# Altium project Jumperless_breadboard_REV1.PrjPcb (part 4 of 4)

## Sheet ESP32 DEV.SchDoc
size A; SheetNumber: 13; SheetTotal: 14
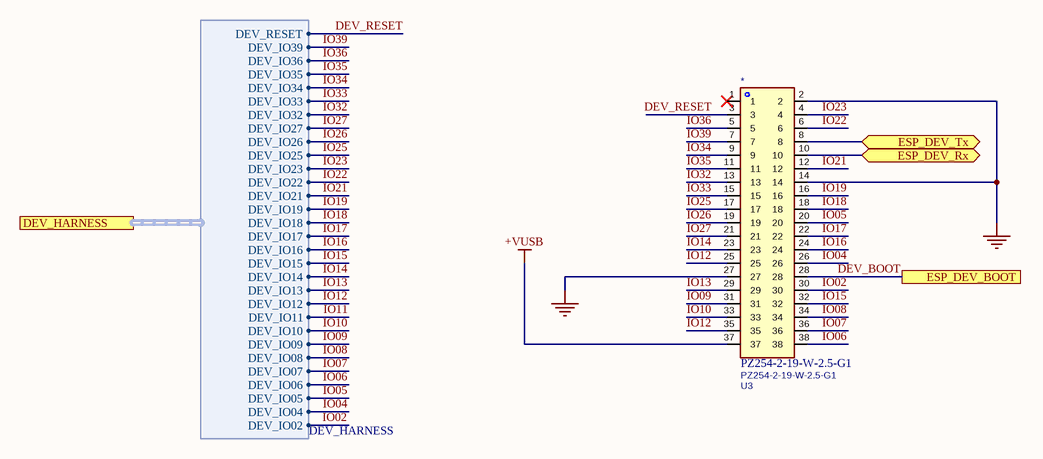
[diagram p30: ESP32 DEV.SchDoc]

### Parts
*  PZ254-2-19-W-2.5-G1  Reference: U3  [HDR-TH_38P-P2.54-H-M-R2-C19-S2.54]

### Ports
DEV_HARNESS (harness DEV_HARNESS), ESP_DEV_BOOT, ESP_DEV_Rx (bidir), ESP_DEV_Tx (bidir)

### Harnesses
DEV_HARNESS: DEV_IO02, DEV_IO04, DEV_IO05, DEV_IO06, DEV_IO07, DEV_IO08, DEV_IO09, DEV_IO10, DEV_IO11, DEV_IO12, DEV_IO13, DEV_IO14, DEV_IO15, DEV_IO16, DEV_IO17, DEV_IO18, DEV_IO19, DEV_IO21, DEV_IO22, DEV_IO23, DEV_IO25, DEV_IO26, DEV_IO27, DEV_IO32, DEV_IO33, DEV_IO34, DEV_IO35, DEV_IO36, DEV_IO39, DEV_RESET

### Nets
+VUSB: *.37  [project net ANALOG_5V]
GND: *.2 *.14 *.27  [project net REF]
DEV_BOOT: *.28 ; port ESP_DEV_BOOT
DEV_RESET: *.3 ; port DEV_HARNESS.DEV_RESET
IO02: *.30 ; port DEV_HARNESS.DEV_IO02  [project net D8]
IO04: *.26 ; port DEV_HARNESS.DEV_IO04  [project net D10]
IO05: *.20 ; port DEV_HARNESS.DEV_IO05  [project net \]
IO06: *.38 ; port DEV_HARNESS.DEV_IO06  [project net D4]
IO07: *.36 ; port DEV_HARNESS.DEV_IO07  [project net A5]
IO08: *.34 ; port DEV_HARNESS.DEV_IO08  [project net D6]
IO09: *.31 ; port DEV_HARNESS.DEV_IO09  [project net A1]
IO10: *.33 ; port DEV_HARNESS.DEV_IO10  [project net D2]
IO12: *.25 *.35 ; port DEV_HARNESS.DEV_IO12  [project net D13]
IO13: *.29 ; port DEV_HARNESS.DEV_IO13  [project net D0]
IO14: *.23 ; port DEV_HARNESS.DEV_IO14  [project net D9]
IO15: *.32 ; port DEV_HARNESS.DEV_IO15  [project net A7]
IO16: *.24 ; port DEV_HARNESS.DEV_IO16  [project net D12]
IO17: *.22 ; port DEV_HARNESS.DEV_IO17  [project net AREF]
IO18: *.18 ; port DEV_HARNESS.DEV_IO18  [project net GPIO39]
IO19: *.16 ; port DEV_HARNESS.DEV_IO19  [project net GPIO40]
IO21: *.12 ; port DEV_HARNESS.DEV_IO21  [project net GPIO41]
IO22: *.6 ; port DEV_HARNESS.DEV_IO22  [project net GPIO42]
IO23: *.4 ; port DEV_HARNESS.DEV_IO23  [project net GPIO45]
IO25: *.17 ; port DEV_HARNESS.DEV_IO25  [project net A6]
IO26: *.19 ; port DEV_HARNESS.DEV_IO26  [project net D7]
IO27: *.21 ; port DEV_HARNESS.DEV_IO27  [project net D11]
IO32: *.13 ; port DEV_HARNESS.DEV_IO32  [project net A4]
IO33: *.15 ; port DEV_HARNESS.DEV_IO33  [project net D5]
IO34: *.9 ; port DEV_HARNESS.DEV_IO34  [project net A2]
IO35: *.11 ; port DEV_HARNESS.DEV_IO35  [project net D3]
IO36: *.5 ; port DEV_HARNESS.DEV_IO36  [project net A0]
IO39: *.7 ; port DEV_HARNESS.DEV_IO39  [project net D1]
Net*_8: *.8 ; port ESP_DEV_Tx
Net*_10: *.10 ; port ESP_DEV_Rx

Not connected (* = marked no-connect by the designer): * 1*

### Library data of the parts
* = PZ254-2-19-W-2.5-G1: Footprint: easyeda2kicad:HDR-TH_38P-P2.54-H-M-R2-C19-S2.54; LCSC Part: C18198033; Value: PZ254-2-19-W-2.5-G1

## Sheet UART_2_MUX.SchDoc
size 250 x 160 mm; SheetNumber: 15; SheetTotal: 15
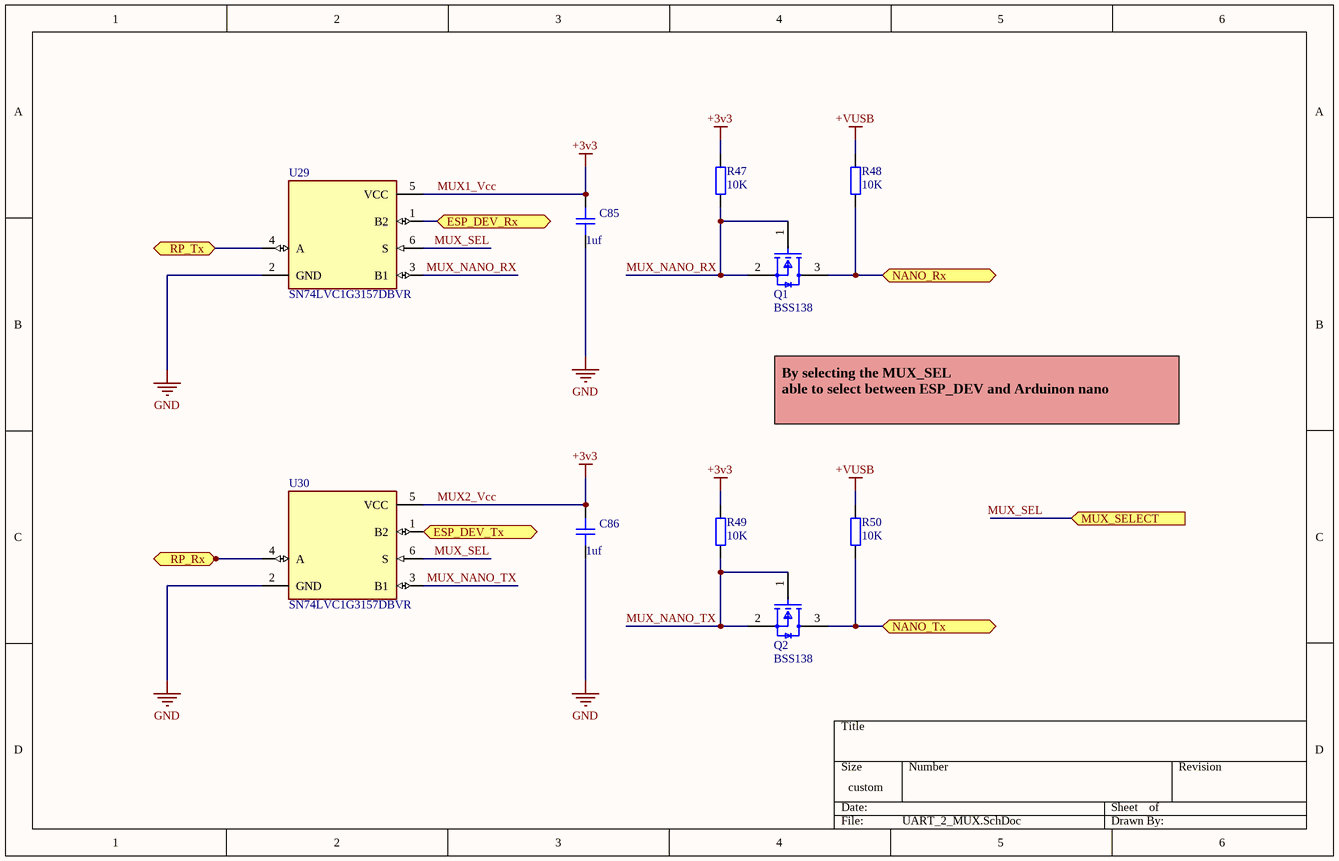
[diagram p31: UART_2_MUX.SchDoc]

### Parts
C85  1uf  [CAP_0603]
C86  1uf  [CAP_0603]
Q1  BSS138  [FP-318-08-IPC_B]
Q2  BSS138  [FP-318-08-IPC_B]
R47  10K  [RES_0603]
R48  10K  [RES_0603]
R49  10K  [RES_0603]
R50  10K  [RES_0603]
U29  SN74LVC1G3157DBVR  [FP-DBV0006A-IPC_C]
U30  SN74LVC1G3157DBVR  [FP-DBV0006A-IPC_C]

### Ports
ESP_DEV_Rx (bidir), ESP_DEV_Tx (bidir), MUX_SELECT (in), NANO_Rx (bidir), NANO_Tx (bidir), RP_Rx (bidir), RP_Tx (bidir)

### Nets
+3v3: C85.2 C86.2 R47.1 R49.1 U29.5(VCC) U30.5(VCC)  [also labelled MUX1_Vcc, MUX2_Vcc]  [project net BUCK1_3v3]
+VUSB: R48.1 R50.1  [project net ANALOG_5V]
GND: C85.1 C86.1 U29.2(GND) U30.2(GND)  [project net REF]
CROSS_Rx: U30.4(A) ; port RP_Rx
CROSS_Tx: U29.4(A) ; port RP_Tx
D0: Q1.3(D) R48.2 ; port NANO_Rx
D1: Q2.3(D) R50.2 ; port NANO_Tx
MUX_NANO_RX: Q1.1(G) Q1.2(S) R47.2 U29.3(B1)  [project net MUX_NANO_RX_15]
MUX_NANO_TX: Q2.1(G) Q2.2(S) R49.2 U30.3(B1)  [project net MUX_NANO_TX_15]
MUX_SEL: U29.6(S) U30.6(S) ; port MUX_SELECT  [project net GPIO0_RP]
Net*_8: U30.1(B2) ; port ESP_DEV_Tx
Net*_10: U29.1(B2) ; port ESP_DEV_Rx

### Notes on the sheet
- By selecting the MUX_SEL
  able to select between ESP_DEV and Arduinon nano

### Library data of the parts
C85 C86 = CAP_0603: Capacitor SMD 0603; Manufacturer: *; Manufacturer Part Number: *; Distributor Link: *; LCSC: *; Rating: *; Dielectric: *
Q1 Q2 = CMP-07173-000101-1: MOSFET N-CH 50V 220MA SOT-23; Turn-Off Delay Time: 20ns; Element Configuration: Single; Rds On Max: 3.5R; Gate to Source Voltage (Vgs): 20V; Threshold Voltage: 1.3V; Number of Elements: 1; Power Dissipation: 360mW; Rise Time: 9ns; Turn-On Delay Time: 2.5ns; Input Capacitance: 27pF; On-State Resistance: 6R; Lead Free: Lead Free; Length: 2.92mm; Width: 1.3mm; Drain to Source Breakdown Voltage: 50V; Min Operating Temperature: -55°C; REACH SVHC: No SVHC; Packaging: Tape and Reel; Radiation Hardening: No; Height: 0.93mm; Drain to Source Voltage (Vdss): 50V; Current Rating: 220mA; Voltage Rating (DC): 50V; Weight: 0.03g; Continuous Drain Current (ID): 220mA; Number of Pins: 3; Nominal Vgs: 1.3V; Max Power Dissipation: 360mW; Fall Time: 9ns; Drain to Source Resistance: 3.5R; Contact Plating: Tin; Case/Package: SOT-23; Package Quantity: 1; Dual Supply Voltage: 50V; Mount: Surface Mount; Termination: SMD/SMT; Max Operating Temperature: 150°C
R47-R50 = RES_0603: Resistor SMD 0603; Manufacturer: *; Manufacturer Part Number: *; Distributor Link: *; LCSC: *
U29 U30 = CMP-0859-00203-4: IC SWITCH SPDT SOT23-6; Number of Outputs: 2; Propagation Delay: 300ps; On-State Resistance: 15R; Nominal Supply Current: 10uA; Number of Inputs: 1; Max Supply Voltage: 5.5V; Supply Type: Single; Low Level Output Current: 128mA; Bandwidth: 300MHz; Turn-Off Delay Time: 3.8ns; Turn-On Delay Time: 5.7ns; Operating Supply Current: 1uA; Min Supply Voltage: 1.65V; Polarity: Non-Inverting; Height: 1.3mm; Number of Bits: 1; Case/Package: SOT-23; REACH SVHC: No SVHC; High Level Output Current: 128mA; Weight: 0.000229oz; Max Supply Current: 10uA; Width: 1.75mm; Radiation Hardening: No; Supply Current: 10uA; Length: 3.05mm; Max Operating Temperature: 125°C; Min Operating Temperature: -40°C; Package Quantity: 3000; Number of Pins: 6; Termination: SMD/SMT; Series: 74LVC; Packaging: Tape and Reel; Lead Free: Lead Free; Contact Plating: Gold; Mount: Surface Mount; RoHS Compliant: Yes; Number of Channels: 1; Throw Configuration: SPDT

## Nets that join several sheets
+8V: Main (S1.1), +-9V Supply (D3.1 R11.1 TP6.1), ANALOG_CIRCUITS (U21.4)
+FUNV: Main (J6.1), 9v_BOOST_CONVERTERS (C81.2 C82.2 D411.1 R44.2)
+OSCV: Main (J5.1), 9v_BOOST_CONVERTERS (C77.2 C78.2 D410.1 R41.2)
-8V: Main (S1.5), +-9V Supply (D9.2 R13.1 TP16.1), ANALOG_CIRCUITS (U21.6)
ANALOG_5V: Main (8 pins), USB MUX (D2.5), +-9V Supply (6 pins), ANALOG_CIRCUITS (C45.2 R26.2 U1.1 U2.4), CONTROL_ROUTING_CROSSPOINTS (U24.1 U26.1), WS2812B_ARRAY (400 pins), 9v_BOOST_CONVERTERS (JP2.2 JP4.2), NANO_HEADER (U31.15), ESP32 DEV (*.37), UART_2_MUX (R48.1 R50.1)
BUCK1_3v3: Main (6 pins), USB MUX (C5.2 SW1.3 SW1.4 U4.4), RP2040 MCU (22 pins), ESP32 S3 MINI (8 pins), ANALOG_CIRCUITS (11 pins), CONTROL_ROUTING_CROSSPOINTS (U23.1), 9v_BOOST_CONVERTERS (JP1.2 JP3.2), UART_2_MUX (6 pins)
CH446_VDD: BREADBOARD_MATTRIX (16 pins), +-9V Supply (5 pins), ANALOG_CIRCUITS (U18.4), CONTROL_ROUTING_CROSSPOINTS (8 pins)
CH446_VEE: BREADBOARD_MATTRIX (8 pins), +-9V Supply (5 pins), ANALOG_CIRCUITS (U18.11), CONTROL_ROUTING_CROSSPOINTS (U23.16 U24.16 U25.16 U26.16)
REF: Main (15 pins), USB MUX (6 pins), BREADBOARD_MATTRIX (80 pins), RP2040 MCU (26 pins), ESP32 S3 MINI (26 pins), +-9V Supply (10 pins), BreadBoard (J3.62 J3.64), ANALOG_CIRCUITS (22 pins), CONTROL_ROUTING_CROSSPOINTS (42 pins), WS2812B_ARRAY (400 pins), 9v_BOOST_CONVERTERS (14 pins), NANO_HEADER (U31.14 U31.19), ESP32 DEV (*.2 *.14 *.27), UART_2_MUX (C85.1 C86.1 U29.2 U30.2)
\: ESP32 S3 MINI (U16.43), CONTROL_ROUTING_CROSSPOINTS (U24.25), NANO_HEADER (U31.13 U31.18), ESP32 DEV (*.20)
A0: ESP32 S3 MINI (U16.6), CONTROL_ROUTING_CROSSPOINTS (U23.31), NANO_HEADER (U31.4), ESP32 DEV (*.5)
A1: ESP32 S3 MINI (U16.18), CONTROL_ROUTING_CROSSPOINTS (U24.30), NANO_HEADER (U31.5), ESP32 DEV (*.31)
A2: ESP32 S3 MINI (U16.8), CONTROL_ROUTING_CROSSPOINTS (U23.29), NANO_HEADER (U31.6), ESP32 DEV (*.9)
A3: ESP32 S3 MINI (U16.23), CONTROL_ROUTING_CROSSPOINTS (U24.28), NANO_HEADER (U31.7)
A4: ESP32 S3 MINI (U16.10), CONTROL_ROUTING_CROSSPOINTS (U23.27), NANO_HEADER (U31.8), ESP32 DEV (*.13)
A5: ESP32 S3 MINI (U16.27), CONTROL_ROUTING_CROSSPOINTS (U24.26), NANO_HEADER (U31.9), ESP32 DEV (*.36)
A6: ESP32 S3 MINI (U16.12), CONTROL_ROUTING_CROSSPOINTS (U23.3), NANO_HEADER (U31.10), ESP32 DEV (*.17)
A7: ESP32 S3 MINI (U16.38), CONTROL_ROUTING_CROSSPOINTS (U24.4), NANO_HEADER (U31.11), ESP32 DEV (*.32)
ADC_BUFF_5V_0: RP2040 MCU (U13.41), ANALOG_CIRCUITS (TP8.1 U2.1 U2.2)
ADC_BUFF_5V_1: RP2040 MCU (U13.40), ANALOG_CIRCUITS (TP9.1 U2.8 U2.9)
ADC_BUFF_5V_2: RP2040 MCU (U13.39), ANALOG_CIRCUITS (TP11.1 U2.13 U2.14)
ADC_BUFF_+-8V: RP2040 MCU (U13.38), ANALOG_CIRCUITS (TP13.1 U2.6 U2.7)
AREF: ESP32 S3 MINI (U16.42), CONTROL_ROUTING_CROSSPOINTS (U24.8), NANO_HEADER (U31.3), ESP32 DEV (*.22)
B_B2: BREADBOARD_MATTRIX (U5.35), BreadBoard (J3.2)
B_B3: BREADBOARD_MATTRIX (U5.37), BreadBoard (J3.3)
B_B4: BREADBOARD_MATTRIX (U5.39), BreadBoard (J3.4)
B_B5: BREADBOARD_MATTRIX (U5.17), BreadBoard (J3.5)
B_B6: BREADBOARD_MATTRIX (U5.15), BreadBoard (J3.6)
B_B7: BREADBOARD_MATTRIX (U5.13), BreadBoard (J3.7)
B_B8: BREADBOARD_MATTRIX (U5.11), BreadBoard (J3.8)
B_B9: BREADBOARD_MATTRIX (U6.35), BreadBoard (J3.9)
B_B10: BREADBOARD_MATTRIX (U6.37), BreadBoard (J3.10)
B_B11: BREADBOARD_MATTRIX (U6.39), BreadBoard (J3.11)
B_B12: BREADBOARD_MATTRIX (U6.17), BreadBoard (J3.12)
B_B13: BREADBOARD_MATTRIX (U6.15), BreadBoard (J3.13)
B_B14: BREADBOARD_MATTRIX (U6.13), BreadBoard (J3.14)
B_B15: BREADBOARD_MATTRIX (U6.11), BreadBoard (J3.15)
B_B16: BREADBOARD_MATTRIX (U7.35), BreadBoard (J3.16)
B_B17: BREADBOARD_MATTRIX (U7.37), BreadBoard (J3.17)
B_B18: BREADBOARD_MATTRIX (U7.39), BreadBoard (J3.18)
B_B19: BREADBOARD_MATTRIX (U7.17), BreadBoard (J3.19)
B_B20: BREADBOARD_MATTRIX (U7.15), BreadBoard (J3.20)
B_B21: BREADBOARD_MATTRIX (U7.13), BreadBoard (J3.21)
B_B22: BREADBOARD_MATTRIX (U7.11), BreadBoard (J3.22)
B_B23: BREADBOARD_MATTRIX (U8.35), BreadBoard (J3.23)
B_B24: BREADBOARD_MATTRIX (U8.37), BreadBoard (J3.24)
B_B25: BREADBOARD_MATTRIX (U8.39), BreadBoard (J3.25)
B_B26: BREADBOARD_MATTRIX (U8.17), BreadBoard (J3.26)
B_B27: BREADBOARD_MATTRIX (U8.15), BreadBoard (J3.27)
B_B28: BREADBOARD_MATTRIX (U8.13), BreadBoard (J3.28)
B_B29: BREADBOARD_MATTRIX (U8.11), BreadBoard (J3.29)
B_B33: BREADBOARD_MATTRIX (U9.35), BreadBoard (J3.33)
B_B34: BREADBOARD_MATTRIX (U9.37), BreadBoard (J3.34)
B_B35: BREADBOARD_MATTRIX (U9.39), BreadBoard (J3.35)
B_B36: BREADBOARD_MATTRIX (U9.17), BreadBoard (J3.36)
B_B37: BREADBOARD_MATTRIX (U9.15), BreadBoard (J3.37)
B_B38: BREADBOARD_MATTRIX (U9.13), BreadBoard (J3.38)
B_B39: BREADBOARD_MATTRIX (U9.11), BreadBoard (J3.39)
B_B40: BREADBOARD_MATTRIX (U10.35), BreadBoard (J3.40)
B_B41: BREADBOARD_MATTRIX (U10.37), BreadBoard (J3.41)
B_B42: BREADBOARD_MATTRIX (U10.39), BreadBoard (J3.42)
B_B43: BREADBOARD_MATTRIX (U10.17), BreadBoard (J3.43)
B_B44: BREADBOARD_MATTRIX (U10.15), BreadBoard (J3.44)
B_B45: BREADBOARD_MATTRIX (U10.13), BreadBoard (J3.45)
B_B46: BREADBOARD_MATTRIX (U10.11), BreadBoard (J3.46)
B_B47: BREADBOARD_MATTRIX (U11.35), BreadBoard (J3.47)
B_B48: BREADBOARD_MATTRIX (U11.37), BreadBoard (J3.48)
B_B49: BREADBOARD_MATTRIX (U11.39), BreadBoard (J3.49)
B_B50: BREADBOARD_MATTRIX (U11.17), BreadBoard (J3.50)
B_B51: BREADBOARD_MATTRIX (U11.15), BreadBoard (J3.51)
B_B52: BREADBOARD_MATTRIX (U11.13), BreadBoard (J3.52)
B_B53: BREADBOARD_MATTRIX (U11.11), BreadBoard (J3.53)
B_B54: BREADBOARD_MATTRIX (U12.35), BreadBoard (J3.54)
B_B55: BREADBOARD_MATTRIX (U12.37), BreadBoard (J3.55)
B_B56: BREADBOARD_MATTRIX (U12.39), BreadBoard (J3.56)
B_B57: BREADBOARD_MATTRIX (U12.17), BreadBoard (J3.57)
B_B58: BREADBOARD_MATTRIX (U12.15), BreadBoard (J3.58)
B_B59: BREADBOARD_MATTRIX (U12.13), BreadBoard (J3.59)
B_B60: BREADBOARD_MATTRIX (U12.11), BreadBoard (J3.60)
BB_1: BreadBoard (J3.1), CONTROL_ROUTING_CROSSPOINTS (U26.5)
BB_30: BreadBoard (J3.30), CONTROL_ROUTING_CROSSPOINTS (U26.6)
BB_31: BreadBoard (J3.31), CONTROL_ROUTING_CROSSPOINTS (U26.8)
BB_32: BreadBoard (J3.32), CONTROL_ROUTING_CROSSPOINTS (U26.7)
BB_BOTTOM_RAIL: Main (S1.7), BreadBoard (J3.63)
BB_TOP_RAIL: Main (S1.3), BreadBoard (J3.61)
CH446_CLK: BREADBOARD_MATTRIX (8 pins), RP2040 MCU (U13.18), CONTROL_ROUTING_CROSSPOINTS (U23.34 U24.34 U25.34 U26.34)
CH446_CS_A: BREADBOARD_MATTRIX (U5.14), RP2040 MCU (U13.8)
CH446_CS_B: BREADBOARD_MATTRIX (U6.14), RP2040 MCU (U13.9)
CH446_CS_C: BREADBOARD_MATTRIX (U7.14), RP2040 MCU (U13.11)
CH446_CS_D: BREADBOARD_MATTRIX (U8.14), RP2040 MCU (U13.12)
CH446_CS_E: BREADBOARD_MATTRIX (U9.14), RP2040 MCU (U13.13)
CH446_CS_F: BREADBOARD_MATTRIX (U10.14), RP2040 MCU (U13.14)
CH446_CS_G: BREADBOARD_MATTRIX (U11.14), RP2040 MCU (U13.15)
CH446_CS_H: BREADBOARD_MATTRIX (U12.14), RP2040 MCU (U13.16)
CH446_CS_I: RP2040 MCU (U13.31), CONTROL_ROUTING_CROSSPOINTS (U23.14)
CH446_CS_J: RP2040 MCU (U13.32), CONTROL_ROUTING_CROSSPOINTS (U24.14)
CH446_CS_K: RP2040 MCU (U13.34), CONTROL_ROUTING_CROSSPOINTS (U25.14)
CH446_CS_L: RP2040 MCU (U13.35), CONTROL_ROUTING_CROSSPOINTS (U26.14)
CH446_DATA: BREADBOARD_MATTRIX (8 pins), RP2040 MCU (U13.17), CONTROL_ROUTING_CROSSPOINTS (U23.36 U24.36 U25.36 U26.36)
CH446_RESET: BREADBOARD_MATTRIX (8 pins), RP2040 MCU (U13.36), CONTROL_ROUTING_CROSSPOINTS (U23.41 U24.41 U25.41 U26.41)
CROSS_AI: BREADBOARD_MATTRIX (U5.31), CONTROL_ROUTING_CROSSPOINTS (U23.33)
CROSS_AJ: BREADBOARD_MATTRIX (U5.30), CONTROL_ROUTING_CROSSPOINTS (U24.33)
CROSS_AK: BREADBOARD_MATTRIX (U5.6), CONTROL_ROUTING_CROSSPOINTS (U25.33)
CROSS_AL: BREADBOARD_MATTRIX (U5.33), CONTROL_ROUTING_CROSSPOINTS (U26.33)
CROSS_BI: BREADBOARD_MATTRIX (U6.29), CONTROL_ROUTING_CROSSPOINTS (U23.35)
CROSS_BJ: BREADBOARD_MATTRIX (U6.28), CONTROL_ROUTING_CROSSPOINTS (U24.35)
CROSS_BK: BREADBOARD_MATTRIX (U6.8), CONTROL_ROUTING_CROSSPOINTS (U25.35)
CROSS_BL: BREADBOARD_MATTRIX (U6.33), CONTROL_ROUTING_CROSSPOINTS (U26.35)
CROSS_CI: BREADBOARD_MATTRIX (U7.27), CONTROL_ROUTING_CROSSPOINTS (U23.37)
CROSS_CJ: BREADBOARD_MATTRIX (U7.26), CONTROL_ROUTING_CROSSPOINTS (U24.37)
CROSS_CK: BREADBOARD_MATTRIX (U7.24), CONTROL_ROUTING_CROSSPOINTS (U25.37)
CROSS_CL: BREADBOARD_MATTRIX (U7.33), CONTROL_ROUTING_CROSSPOINTS (U26.37)
CROSS_DI: BREADBOARD_MATTRIX (U8.3), CONTROL_ROUTING_CROSSPOINTS (U23.39)
CROSS_DJ: BREADBOARD_MATTRIX (U8.4), CONTROL_ROUTING_CROSSPOINTS (U24.39)
CROSS_DK: BREADBOARD_MATTRIX (U8.2), CONTROL_ROUTING_CROSSPOINTS (U25.39)
CROSS_DL: BREADBOARD_MATTRIX (U8.33), CONTROL_ROUTING_CROSSPOINTS (U26.39)
CROSS_EI: BREADBOARD_MATTRIX (U9.30), CONTROL_ROUTING_CROSSPOINTS (U23.17)
CROSS_EJ: BREADBOARD_MATTRIX (U9.5), CONTROL_ROUTING_CROSSPOINTS (U24.17)
CROSS_EK: BREADBOARD_MATTRIX (U9.6), CONTROL_ROUTING_CROSSPOINTS (U25.17)
CROSS_EL: BREADBOARD_MATTRIX (U9.33), CONTROL_ROUTING_CROSSPOINTS (U26.17)
CROSS_FI: BREADBOARD_MATTRIX (U10.28), CONTROL_ROUTING_CROSSPOINTS (U23.15)
CROSS_FJ: BREADBOARD_MATTRIX (U10.7), CONTROL_ROUTING_CROSSPOINTS (U24.15)
CROSS_FK: BREADBOARD_MATTRIX (U10.8), CONTROL_ROUTING_CROSSPOINTS (U25.15)
CROSS_FL: BREADBOARD_MATTRIX (U10.33), CONTROL_ROUTING_CROSSPOINTS (U26.15)
CROSS_GI: BREADBOARD_MATTRIX (U11.26), CONTROL_ROUTING_CROSSPOINTS (U23.13)
CROSS_GJ: BREADBOARD_MATTRIX (U11.25), CONTROL_ROUTING_CROSSPOINTS (U24.13)
CROSS_GK: BREADBOARD_MATTRIX (U11.24), CONTROL_ROUTING_CROSSPOINTS (U25.13)
CROSS_GL: BREADBOARD_MATTRIX (U11.33), CONTROL_ROUTING_CROSSPOINTS (U26.13)
CROSS_HI: BREADBOARD_MATTRIX (U12.4), CONTROL_ROUTING_CROSSPOINTS (U23.11)
CROSS_HJ: BREADBOARD_MATTRIX (U12.1), CONTROL_ROUTING_CROSSPOINTS (U24.11)
CROSS_HK: BREADBOARD_MATTRIX (U12.2), CONTROL_ROUTING_CROSSPOINTS (U25.11)
CROSS_HL: BREADBOARD_MATTRIX (U12.33), CONTROL_ROUTING_CROSSPOINTS (U26.11)
CROSS_Rx: RP2040 MCU (U13.27), CONTROL_ROUTING_CROSSPOINTS (U26.25), UART_2_MUX (U30.4)
CROSS_Tx: RP2040 MCU (U13.28), CONTROL_ROUTING_CROSSPOINTS (U26.24), UART_2_MUX (U29.4)
CURRENT_SCL: RP2040 MCU (R35.1 U13.7 U15.5), ANALOG_CIRCUITS (R17.1 R20.1 U19.4 U20.4)
CURRENT_SDA: RP2040 MCU (R36.1 U13.6 U15.6), ANALOG_CIRCUITS (R16.1 R19.1 U19.3 U20.3)
D0: ESP32 S3 MINI (U16.17), CONTROL_ROUTING_CROSSPOINTS (U24.31), NANO_HEADER (U31.17), ESP32 DEV (*.29), UART_2_MUX (Q1.3 R48.2)
D1: ESP32 S3 MINI (U16.7), CONTROL_ROUTING_CROSSPOINTS (U23.30), NANO_HEADER (U31.16), ESP32 DEV (*.7), UART_2_MUX (Q2.3 R50.2)
D2: ESP32 S3 MINI (U16.19), CONTROL_ROUTING_CROSSPOINTS (U24.29), NANO_HEADER (U31.20), ESP32 DEV (*.33)
D3: ESP32 S3 MINI (U16.9), CONTROL_ROUTING_CROSSPOINTS (U23.28), NANO_HEADER (U31.21), ESP32 DEV (*.11)
D4: ESP32 S3 MINI (U16.24), CONTROL_ROUTING_CROSSPOINTS (U24.27), NANO_HEADER (U31.22), ESP32 DEV (*.38)
D5: ESP32 S3 MINI (U16.11), CONTROL_ROUTING_CROSSPOINTS (U23.26), NANO_HEADER (U31.23), ESP32 DEV (*.15)
D6: ESP32 S3 MINI (U16.28), CONTROL_ROUTING_CROSSPOINTS (U24.3), NANO_HEADER (U31.24), ESP32 DEV (*.34)
D7: ESP32 S3 MINI (U16.13), CONTROL_ROUTING_CROSSPOINTS (U23.4), NANO_HEADER (U31.25), ESP32 DEV (*.19)
D8: ESP32 S3 MINI (U16.39), CONTROL_ROUTING_CROSSPOINTS (U24.5), NANO_HEADER (U31.26), ESP32 DEV (*.30)
D9: ESP32 S3 MINI (U16.15), CONTROL_ROUTING_CROSSPOINTS (U23.6), NANO_HEADER (U31.27), ESP32 DEV (*.23)
D10: ESP32 S3 MINI (U16.40), CONTROL_ROUTING_CROSSPOINTS (U24.6), NANO_HEADER (U31.28), ESP32 DEV (*.26)
D11: ESP32 S3 MINI (U16.14), CONTROL_ROUTING_CROSSPOINTS (U23.5), NANO_HEADER (U31.29), ESP32 DEV (*.21)
D12: ESP32 S3 MINI (U16.41), CONTROL_ROUTING_CROSSPOINTS (U24.7), NANO_HEADER (U31.30), ESP32 DEV (*.24)
D13: ESP32 S3 MINI (U16.16), CONTROL_ROUTING_CROSSPOINTS (U23.7), NANO_HEADER (U31.1), ESP32 DEV (*.25 *.35)
DAC-SS: RP2040 MCU (U13.3), ANALOG_CIRCUITS (U1.2)
DAC_CLOCK: RP2040 MCU (U13.4), ANALOG_CIRCUITS (U1.3)
DAC_DATA: RP2040 MCU (U13.5), ANALOG_CIRCUITS (U1.4)
DEV_BOOT: ESP32 S3 MINI (U16.37), CONTROL_ROUTING_CROSSPOINTS (U25.3), ESP32 DEV (*.28)
DEV_RESET: ESP32 S3 MINI (U16.36), CONTROL_ROUTING_CROSSPOINTS (U25.4), ESP32 DEV (*.3)
ESP32_Rx: RP2040 MCU (U13.29), ESP32 S3 MINI (U16.49)
ESP32_Tx: RP2040 MCU (U13.30), ESP32 S3 MINI (U16.50)
ESP_N: USB MUX (U4.12), ESP32 S3 MINI (U16.25)
ESP_P: USB MUX (U4.11), ESP32 S3 MINI (U16.26)
ESP_RESET: ESP32 S3 MINI (C71.2 R38.1 SW4.2 U16.4), CONTROL_ROUTING_CROSSPOINTS (U23.8)
EX_GND: Main (J5.3 JP6.1), CONTROL_ROUTING_CROSSPOINTS (U25.6)
EXT_1: Main (J6.5), CONTROL_ROUTING_CROSSPOINTS (U25.25)
EXT_2: Main (J6.6), CONTROL_ROUTING_CROSSPOINTS (U25.24)
EXT_3: Main (J4.3), CONTROL_ROUTING_CROSSPOINTS (U25.1)
GPIO0_RP: RP2040 MCU (R40.1), CONTROL_ROUTING_CROSSPOINTS (U26.2), UART_2_MUX (U29.6 U30.6)
GPIO39: ESP32 S3 MINI (U16.44), CONTROL_ROUTING_CROSSPOINTS (U25.31), ESP32 DEV (*.18)
GPIO40: ESP32 S3 MINI (U16.45), CONTROL_ROUTING_CROSSPOINTS (U25.30), ESP32 DEV (*.16)
GPIO41: ESP32 S3 MINI (U16.47), CONTROL_ROUTING_CROSSPOINTS (U25.29), ESP32 DEV (*.12)
GPIO42: ESP32 S3 MINI (U16.48), CONTROL_ROUTING_CROSSPOINTS (U25.28), ESP32 DEV (*.6)
GPIO45: Main (J5.5), ESP32 S3 MINI (U16.51), CONTROL_ROUTING_CROSSPOINTS (U25.27), ESP32 DEV (*.4)
GPIO46: Main (J5.4), ESP32 S3 MINI (U16.52), CONTROL_ROUTING_CROSSPOINTS (U25.26)
Net*_8: ESP32 DEV (*.8), UART_2_MUX (U30.1)
Net*_10: ESP32 DEV (*.10), UART_2_MUX (U29.1)
NetC51_2: ANALOG_CIRCUITS (C51.2 R32.1 U21.5), CONTROL_ROUTING_CROSSPOINTS (U26.3)
NetR18_1: ANALOG_CIRCUITS (R18.1 U19.7), CONTROL_ROUTING_CROSSPOINTS (U26.31)
NetR18_2: ANALOG_CIRCUITS (R18.2 TP7.1 U19.8), CONTROL_ROUTING_CROSSPOINTS (U26.30)
NetU18_3: ANALOG_CIRCUITS (U18.3), CONTROL_ROUTING_CROSSPOINTS (U23.24 U26.29)
NetU18_5: ANALOG_CIRCUITS (U18.5), CONTROL_ROUTING_CROSSPOINTS (U26.26)
NetU18_10: ANALOG_CIRCUITS (U18.10), CONTROL_ROUTING_CROSSPOINTS (U24.24 U26.28)
NetU18_12: ANALOG_CIRCUITS (U18.12), CONTROL_ROUTING_CROSSPOINTS (U25.2 U26.27)
OSC_PROBE: Main (J5.2), CONTROL_ROUTING_CROSSPOINTS (U25.5)
RGB_CONTROL: RP2040 MCU (U13.37), WS2812B_ARRAY (D10.3)
RP_N: USB MUX (U4.14), RP2040 MCU (U13.46)
RP_P: USB MUX (U4.13), RP2040 MCU (U13.47)
SINE_TRANG_WAV: Main (J6.4), CONTROL_ROUTING_CROSSPOINTS (U25.8)
SQUARE_WAV: Main (J6.3), CONTROL_ROUTING_CROSSPOINTS (U25.7)
USB_N: Main (J1.A7 J1.B7), USB MUX (D2.3)
USB_P: Main (J1.A6 J1.B6), USB MUX (D2.1)